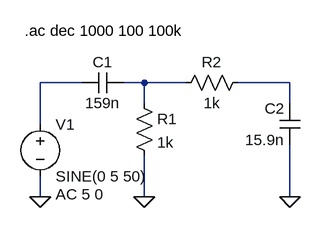
[diagram p0: schematic tworcbandpass.asc]
tworcbandpass.asc, the LTspice schematic file:
Version 4.1
SHEET 1 880 680
WIRE 144 80 80 80
WIRE 240 80 208 80
WIRE 304 80 240 80
WIRE 464 80 384 80
WIRE 240 112 240 80
WIRE 464 112 464 80
WIRE 80 144 80 80
WIRE 80 256 80 224
WIRE 240 256 240 192
WIRE 464 256 464 176
FLAG 80 256 0
FLAG 240 256 0
FLAG 464 256 0
SYMBOL voltage 80 128 R0
WINDOW 123 24 124 Left 2
WINDOW 39 0 0 Left 0
SYMATTR InstName V1
SYMATTR Value SINE(0 5 50)
SYMATTR Value2 AC 5 0
SYMBOL cap 208 64 R90
WINDOW 0 0 32 VBottom 2
WINDOW 3 32 32 VTop 2
SYMATTR InstName C1
SYMATTR Value 159n
SYMBOL cap 480 176 R180
WINDOW 0 24 56 Left 2
WINDOW 3 24 8 Left 2
SYMATTR InstName C2
SYMATTR Value 15.9n
SYMBOL res 224 96 R0
SYMATTR InstName R1
SYMATTR Value 1k
SYMBOL res 400 64 R90
WINDOW 0 0 56 VBottom 2
WINDOW 3 32 56 VTop 2
SYMATTR InstName R2
SYMATTR Value 1k
TEXT 56 0 Left 2 !.ac dec 1000 100 100k

The netlist it stands for:
* tworcbandpass.asc
V1 N001 0 SINE(0 5 50) AC 5 0
C1 N002 N001 159n
C2 0 N003 15.9n
R1 N002 0 1k
R2 N003 N002 1k
.ac dec 1000 100 100k
.backanno
.end